# Altium schematic sheet CW308_K82.SchDoc: K82 Microcontroller
size Letter; Organization: NewAE Technology Inc.; Address1: 1083 Queen St., Suite 196; Address2: Halifax; Address3: NS; Address4: Canada B3H 0B2; SheetApproved: NO
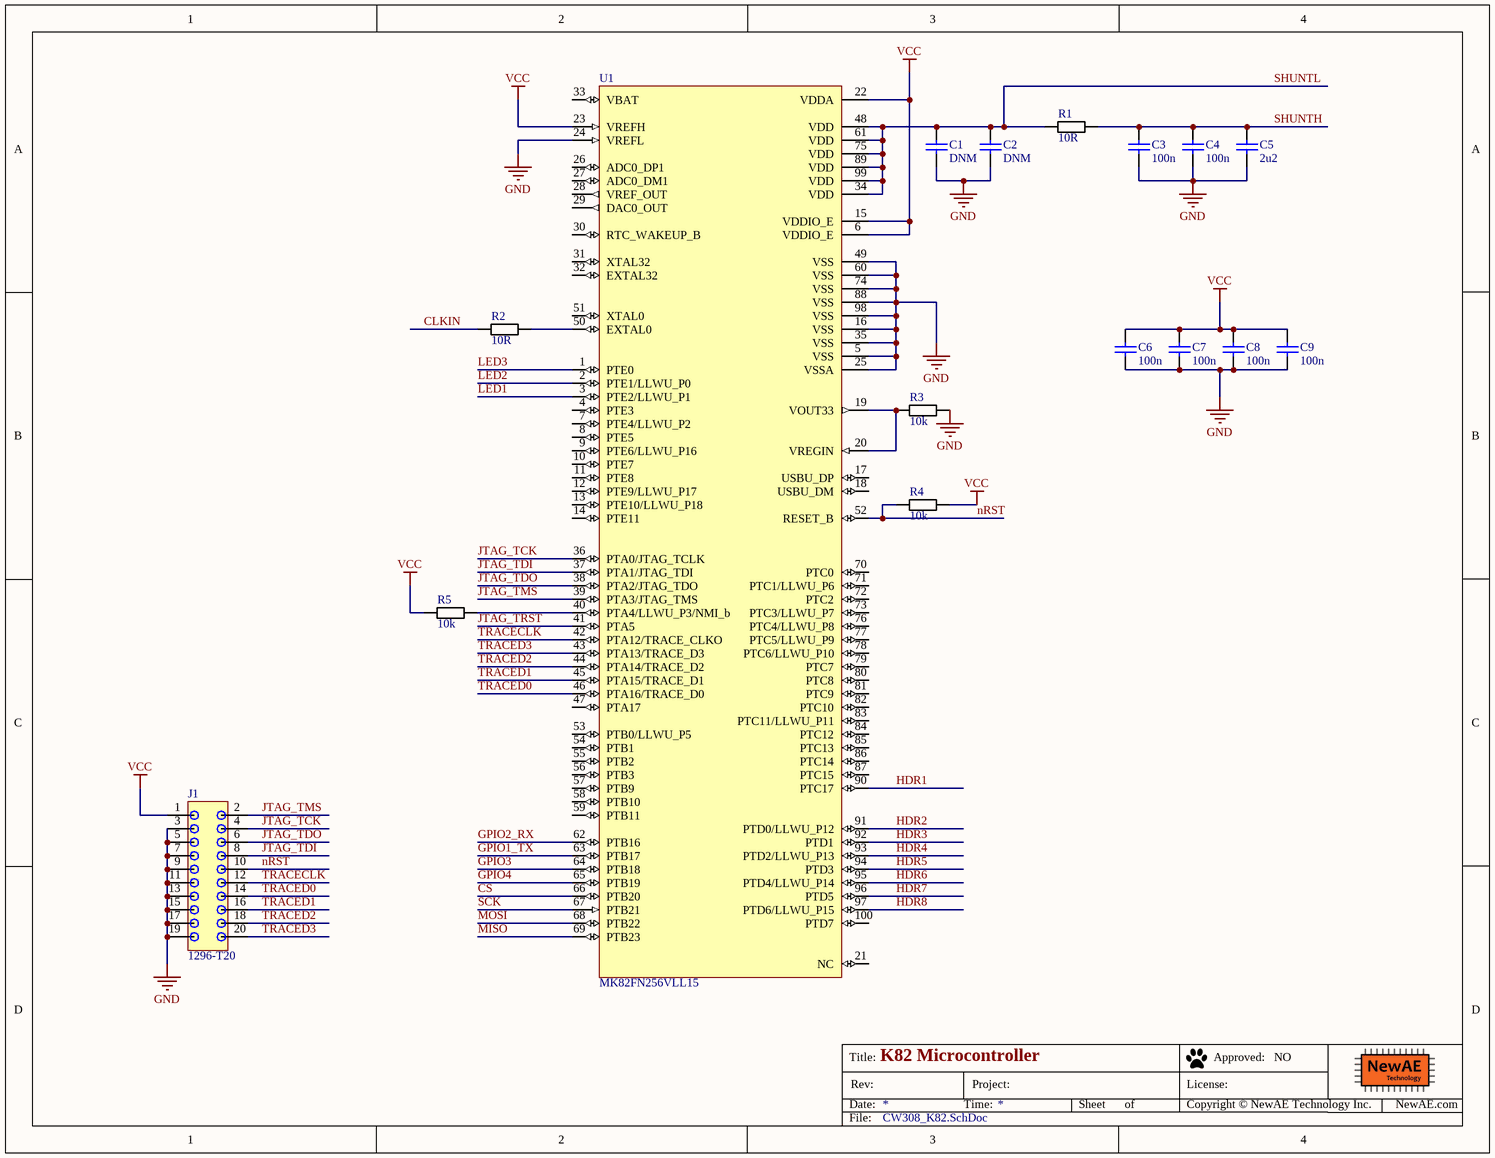
[diagram p0: CW308_K82.SchDoc]

## Parts
C1  DNM  [CAPC0603_M]
C2  DNM  [CAPC0603_M]
C3  100n  [CAPC0603_M]
C4  100n  [CAPC0603_M]
C5  2u2  [CAPC0603_M]
C6  100n  [CAPC0603_M]
C7  100n  [CAPC0603_M]
C8  100n  [CAPC0603_M]
C9  100n  [CAPC0603_M]
J1  1296-T20  [1296-T20]
R1  10R  [RESC1608X55N]
R2  10R  [RESC1608X55N]
R3  10k  [RESC1608X55N]
R4  10k  [RESC1608X55N]
R5  10k  [RESC1608X55N]
U1  MK82FN256VLL15  [SQFP50P1600X1600X170-100N]

## Nets
GND: C1.2 C2.2 C3.2 C4.2 C5.2 C6.2 C7.2 C8.2 C9.2 J1.3 J1.5 J1.7 J1.9 J1.11 J1.13 J1.15 J1.17 J1.19 R3.2 U1.5(VSS) U1.16(VSS) U1.24(VREFL) U1.25(VSSA) U1.35(VSS) U1.49(VSS) U1.60(VSS) U1.74(VSS) U1.88(VSS) U1.98(VSS)
VCC: C6.1 C7.1 C8.1 C9.1 J1.1 R4.2 R5.1 U1.6(VDDIO_E) U1.15(VDDIO_E) U1.22(VDDA) U1.23(VREFH)
CLKIN: R2.1
CS: U1.66(PTB20)
GPIO1_TX: U1.63(PTB17)
GPIO2_RX: U1.62(PTB16)
GPIO3: U1.64(PTB18)
GPIO4: U1.65(PTB19)
HDR1: U1.90(PTC17)
HDR2: U1.91(PTD0/LLWU_P12)
HDR3: U1.92(PTD1)
HDR4: U1.93(PTD2/LLWU_P13)
HDR5: U1.94(PTD3)
HDR6: U1.95(PTD4/LLWU_P14)
HDR7: U1.96(PTD5)
HDR8: U1.97(PTD6/LLWU_P15)
JTAG_TCK: J1.4 U1.36(PTA0/JTAG_TCLK)
JTAG_TDI: J1.8 U1.37(PTA1/JTAG_TDI)
JTAG_TDO: J1.6 U1.38(PTA2/JTAG_TDO)
JTAG_TMS: J1.2 U1.39(PTA3/JTAG_TMS)
JTAG_TRST: U1.41(PTA5)
LED1: U1.3(PTE2/LLWU_P1)
LED2: U1.2(PTE1/LLWU_P0)
LED3: U1.1(PTE0)
MISO: U1.69(PTB23)
MOSI: U1.68(PTB22)
nRST: J1.10 R4.1 U1.52(RESET_B)
SCK: U1.67(PTB21)
SHUNTH: C3.1 C4.1 C5.1 R1.2
SHUNTL: C1.1 C2.1 R1.1 U1.34(VDD) U1.48(VDD) U1.61(VDD) U1.75(VDD) U1.89(VDD) U1.99(VDD)
TRACECLK: J1.12 U1.42(PTA12/TRACE_CLKO)
TRACED0: J1.14 U1.46(PTA16/TRACE_D0)
TRACED1: J1.16 U1.45(PTA15/TRACE_D1)
TRACED2: J1.18 U1.44(PTA14/TRACE_D2)
TRACED3: J1.20 U1.43(PTA13/TRACE_D3)
NetR2_2: R2.2 U1.50(EXTAL0)
NetR3_1: R3.1 U1.19(VOUT33) U1.20(VREGIN)
NetR5_2: R5.2 U1.40(PTA4/LLWU_P3/NMI_b)

Not connected (* = marked no-connect by the designer): U1 4(PTE3) 7(PTE4/LLWU_P2) 8(PTE5) 9(PTE6/LLWU_P16) 10(PTE7) 11(PTE8) 12(PTE9/LLWU_P17) 13(PTE10/LLWU_P18) 14(PTE11) 17(USBU_DP) 18(USBU_DM) 21(NC) 26(ADC0_DP1) 27(ADC0_DM1) 28(VREF_OUT) 29(DAC0_OUT) 30(RTC_WAKEUP_B) 31(XTAL32) 32(EXTAL32) 33(VBAT) 47(PTA17) 51(XTAL0) 53(PTB0/LLWU_P5) 54(PTB1) 55(PTB2) 56(PTB3) 57(PTB9) 58(PTB10) 59(PTB11) 70(PTC0) 71(PTC1/LLWU_P6) 72(PTC2) 73(PTC3/LLWU_P7) 76(PTC4/LLWU_P8) 77(PTC5/LLWU_P9) 78(PTC6/LLWU_P10) 79(PTC7) 80(PTC8) 81(PTC9) 82(PTC10) 83(PTC11/LLWU_P11) 84(PTC12) 85(PTC13) 86(PTC14) 87(PTC15) 100(PTD7)

## Notes on the sheet
- Title:
- Date:
- Rev:
- Time:
- Project:
- Sheet
- of
- License:
- Copyright © NewAE Technology Inc.
- Approved:
- NewAE.com
- File:

## Library data of the parts
C1 C2 = CCHIP-100n-0603: Manufacture 1: Kemet; Manufacture Part Number 1: C0603C104K5RACTU; Component Group: Capacitor; Value: 100n; Case-EIA: 0603; Case-Metric: 1608; Rated Voltage: 50VDC; Part Number: CCHIP-100n-0603; Footprint: 0603; Pin Count: 2; Supplier 1: Digi-Key; Supplier Part Number 1: 399-5089-2-ND; Mounting Technology: SMT; Component Kind: Standard; Component Type: Standard
C3 C4 C6-C9 = CCHIP-100n-0603: 100n, 0603; Manufacture 1: Kemet; Manufacture Part Number 1: C0603C104K5RACTU; Component Group: Capacitor; Case-EIA: 0603; Case-Metric: 1608; Rated Voltage: 50VDC; Part Number: CCHIP-100n-0603; Footprint: 0603; Pin Count: 2; Supplier 1: Digi-Key; Supplier Part Number 1: 399-5089-2-ND; Value: 100n; Mounting Technology: SMT; Component Kind: Standard; Component Type: Standard
C5 = CCHIP-2u2-0603: 2u2, 0603; Manufacture 1: Samsung; Manufacture Part Number 1: CL10B225KP8NNNC; Component Group: Capacitor; Case-EIA: 0603; Case-Metric: 1608; Rated Voltage: 10VDC; Part Number: CCHIP-2u2-0603; Footprint: 0603; Pin Count: 2; Supplier 1: Digi-Key; Supplier Part Number 1: 1276-1134-2-ND; Value: 2u2; Mounting Technology: SMT; Component Kind: Standard; Component Type: Standard
J1 = 1296-T20: Header, 20-pin, SMD, 0.05"; Component Group: Connector; Part Number: 1296-T20; Pin Count: 20; Mounting Technology: SMT; Component Kind: Standard; Component Type: Standard
R1 R2 = RCHIP-10R-0603: 10R res, 0603, 1%, 1/10W; Manufacture 1: Yageo; Manufacture Part Number 1: RC0603FR-0710RL; Component Group: Resistor; Case-EIA: 0603; Case-Metric: 1608; Rated Power: 0.1W; Rated Voltage: 75VDC; Part Number: RCHIP-10R-0603; Footprint: 0603; Pin Count: 2; Supplier 1: Digi-Key; Supplier Part Number 1: 311-10.0HRCT-ND; Value: 10R; Tolerance: 1%; Mounting Technology: SMT; Temperature Range: -55C to 155C; Component Kind: Standard; Component Type: Standard
R3-R5 = RCHIP-10K-0603: 10k res, 0603, 1%, 1/10W; Manufacture 1: Yageo; Manufacture Part Number 1: RC0603FR-0710KL; Component Group: Resistor; Case-EIA: 0603; Case-Metric: 1608; Rated Power: 0.1W; Rated Voltage: 75VDC; Part Number: RCHIP-10K-0603; Footprint: 0603; Pin Count: 2; Supplier 1: Digi-Key; Supplier Part Number 1: 311-10.0KHRCT-ND; Value: 10k; Tolerance: 1%; Mounting Technology: SMT; Temperature Range: -55C to 155C; Component Kind: Standard; Component Type: Standard
U1 = MK82FN256VLL15: ARM® Cortex®-M4 Kinetis K8x Microcontroller IC 32-Bit 150MHz 256KB (256K x 8) FLASH 100-LQFP (14x14); Manufacture 1: NXP; Component Group: Digital IC; PP Material Stack: 0; Part Number: MK82FN256VLL15; Footprint: TQFP100; Manufacture Part Number 1: MK82FN256VLL15; Pin Count: 100; Supplier 1: Digi-Key; Supplier Part Number 1: MK82FN256VLL15-ND; Mounting Technology: SMT; RoHS: Yes; Component Kind: Standard; Component Type: Standard; PP Rotation: 0